# EAGLE design 2lampen (EAGLE 6.3)
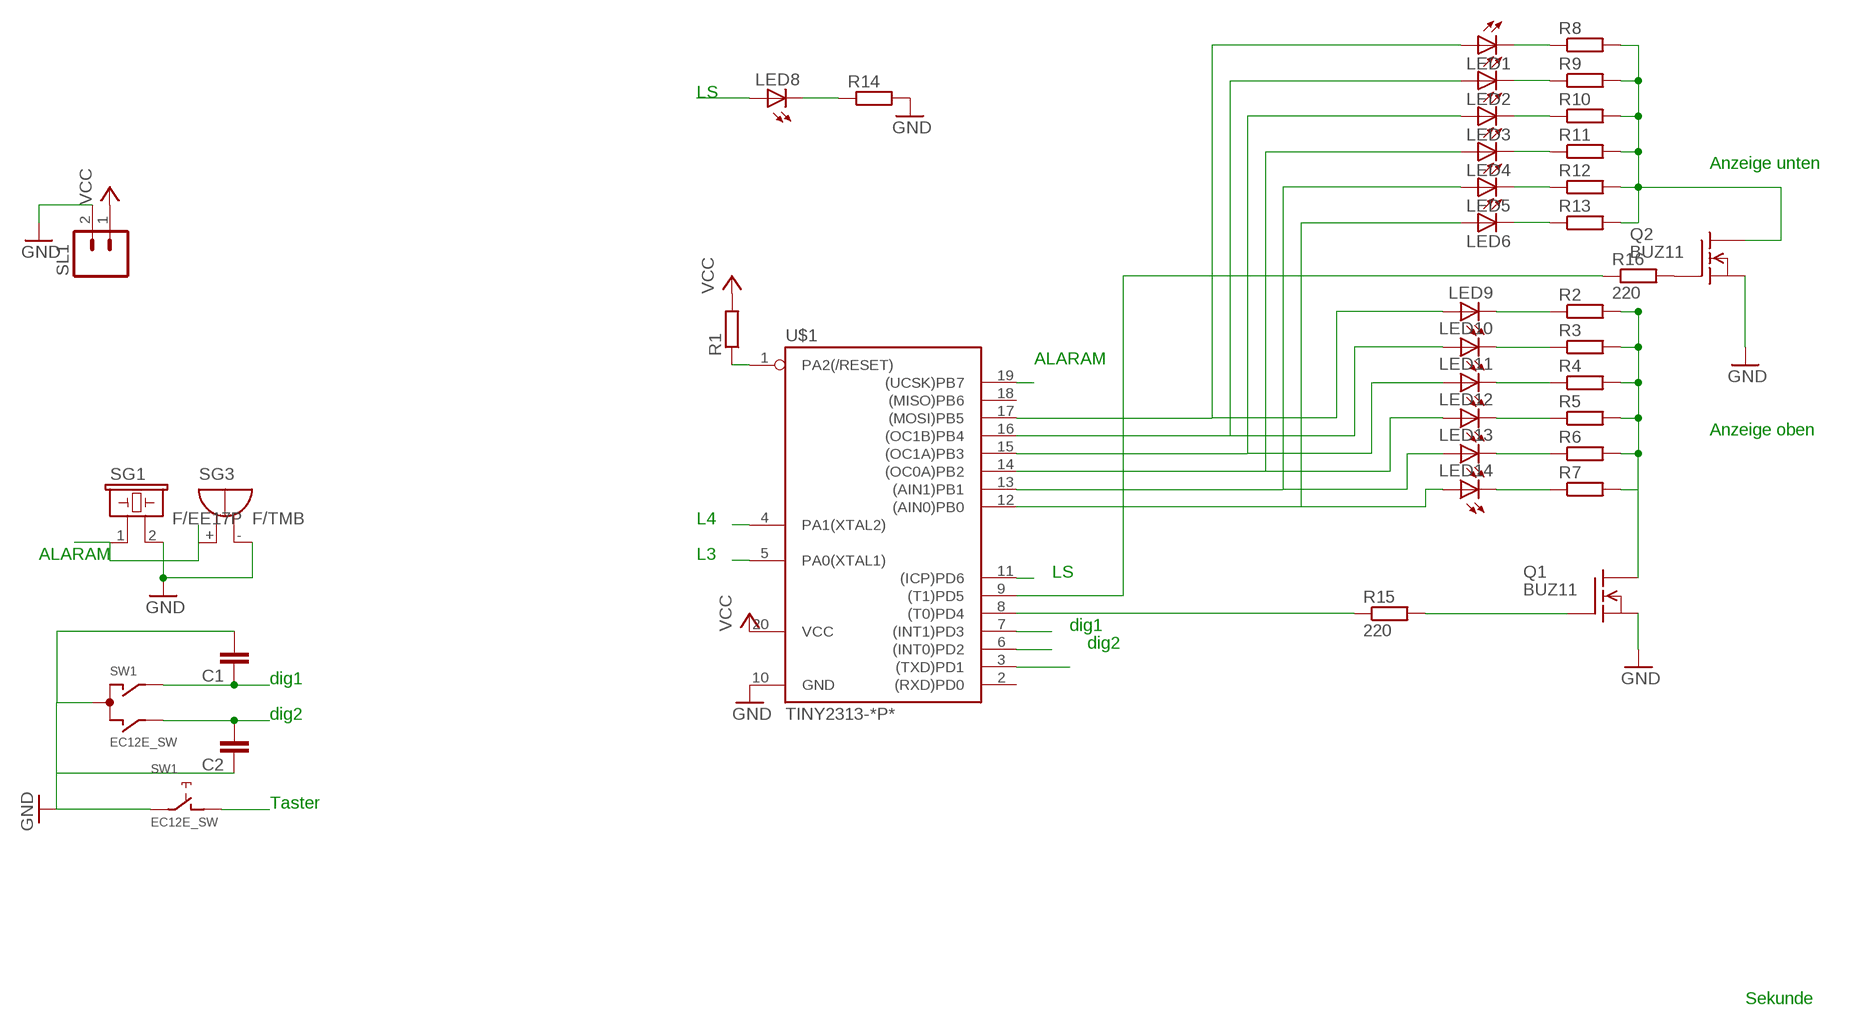
[diagram p0: schematic, sheet 1]

## Parts
C1  C-EU025-025X050  [C025-025X050]
C2  C-EU025-025X050  [C025-025X050]
LED1  LED5MM  [LED5MM]
LED2  LED5MM  [LED5MM]
LED3  LED5MM  [LED5MM]
LED4  LED5MM  [LED5MM]
LED5  LED5MM  [LED5MM]
LED6  LED5MM  [LED5MM]
LED8  LED3MM  [LED3MM]
LED9  LED5MM  [LED5MM]
LED10  LED5MM  [LED5MM]
LED11  LED5MM  [LED5MM]
LED12  LED5MM  [LED5MM]
LED13  LED5MM  [LED5MM]
LED14  LED5MM  [LED5MM]
Q1  BUZ11  [TO220]
Q2  BUZ11  [TO220]
R1  R-EU_0204/7  [0204/7]
R2  R-EU_0204/2V  [0204V]
R3  R-EU_0204/2V  [0204V]
R4  R-EU_0204/2V  [0204V]
R5  R-EU_0204/2V  [0204V]
R6  R-EU_0204/2V  [0204V]
R7  R-EU_0204/2V  [0204V]
R8  R-EU_0204/2V  [0204V]
R9  R-EU_0204/2V  [0204V]
R10  R-EU_0204/2V  [0204V]
R11  R-EU_0204/2V  [0204V]
R12  R-EU_0204/2V  [0204V]
R13  R-EU_0204/7  [0204/7]
R14  R-EU_0204/2V  [0204V]
R15  220  R-EU_0204/2V  [0204V]
R16  220  R-EU_0204/2V  [0204V]
SG1  F/EE17P  [F/EE17P]
SG3  F/TMB  [F/TMB]
SL1  M02  [02P]
SW1  EC12E_SW  [ALPS_EC12E_SW]
U$1  TINY2313-*P*  [DIL20]

## Nets
ALARM: SG1.1 SG3.+ U$1.19((UCSK)PB7)
DIG1: C1.1 SW1.A U$1.7((INT1)PD3)
DIG2: C2.2 SW1.B U$1.6((INT0)PD2)
GND: C1.2 C2.1 Q1.3(S) Q2.3(S) R14.2 SG1.2 SG3.- SL1.2 SW1.C SW1.E U$1.10(GND)
L1: LED1.A LED9.A U$1.17((MOSI)PB5)
L2: LED2.A LED10.A U$1.16((OC1B)PB4)
L3: LED3.A LED11.A U$1.5(PA0(XTAL1)) U$1.15((OC1A)PB3)
L4: LED4.A LED12.A U$1.4(PA1(XTAL2)) U$1.14((OC0A)PB2)
L5: LED5.A LED13.A U$1.13((AIN1)PB1)
L6: LED6.A LED14.A U$1.12((AIN0)PB0)
LS: LED8.A U$1.11((ICP)PD6)
N$1: LED6.K(C) R13.1
N$2: LED5.K(C) R12.1
N$3: LED4.K(C) R11.1
N$4: LED3.K(C) R10.1
N$5: Q1.2(D) R2.2 R3.2 R4.2 R5.2 R6.2 R7.2
N$6: LED2.K(C) R9.1
N$7: U$1.3((TXD)PD1)
N$8: LED1.K(C) R8.1
N$10: LED8.K(C) R14.1
N$17: LED9.K(C) R2.1
N$18: LED10.K(C) R3.1
N$19: LED11.K(C) R4.1
N$20: LED12.K(C) R5.1
N$21: LED13.K(C) R6.1
N$22: LED14.K(C) R7.1
N$30: Q2.2(D) R8.2 R9.2 R10.2 R11.2 R12.2 R13.2
N$31: Q1.1(G) R15.2
N$32: Q2.1(G) R16.2
N$33: R16.1 U$1.9((T1)PD5)
N$34: R15.1 U$1.8((T0)PD4)
RESET: R1.1 U$1.1(PA2(/RESET))
TAST: SW1.D
VCC: R1.2 SL1.1 U$1.20(VCC)
Unconnected: SW1.GND1(G) SW1.GND2(G) U$1.2((RXD)PD0) U$1.18((MISO)PB6)

## Notes on the sheet
- LS
- Anzeige unten
- ALARAM
- Anzeige oben
- L4
- ALARAM | L3
- LS
- dig1
- dig2
- dig1
- dig2
- Taster
- Sekunde

## Library data of the parts
C1 C2 = rcl:C-EU: CAPACITOR, European symbol
LED1-LED6 LED8-LED14 = led:LED: LED OSRAM: - CHIPLED LG R971, LG N971, LY N971, LG Q971, LY Q971, LO R971, LY R971 LH N974, LH R974 LS Q976, LO Q976, LY Q976 LO Q996 - Hyper CHIPLED LW Q18S LB Q993, LB Q99A, LB R99A - SideLED LS A670, LO A670, LY A670, LG A670, LP A670 LB A673, LV A673, LT A673, LW A673 LH A674 LY A675 LS A676, LA A676, LO A676, LY A676, LW A676 LS A679, LY A679, LG A679 - Hyper Micro SIDELED® LS Y876, LA Y876, LO Y876, LY Y876 LT Y87S - SmartLED LW L88C, LW L88S LB L89C, LB L89S, LG L890 LS L89K, LO L89K, LY L89K LS L896, LA L896, LO L896, LY L896 - TOPLED LS T670, LO T670, LY T670, LG T670, LP T670 LSG T670, LSP T670, LSY T670, LOP T670, LYG T670 LG T671, LOG T671, LSG T671 LB T673, LV T673, LT T673, LW T673 LH T674 LS T676, LA T676, LO T676, LY T676, LB T676, LH T676, LSB T676, LW T676 LB T67C, LV T67C, LT T67C, LS T67K, LO T67K, LY T67K, LW E67C LS E67B, LA E67B, LO E67B, LY E67B, LB E67C, LV E67C, LT E67C LW T67C LS T679, LY T679, LG T679 LS T770, LO T770, LY T770, LG T770, LP T770 LB T773, LV T773, LT T773, LW T773 LH T774 LS E675, LA E675, LY E675, LS T675 LS T776, LA T776, LO T776, LY T776, LB T776 LHGB T686 LT T68C, LB T68C - Hyper Mini TOPLED® LB M676 - Mini TOPLED Santana® LG M470 LS M47K, LO M47K, LY M47K Source: http://www.osram.convergy.de LUXEON: - LUMILED® LXK2-PW12-R00, LXK2-PW12-S00, LXK2-PW14-U00, LXK2-PW14-V00 LXK2-PM12-R00, LXK2-PM12-S00, LXK2-PM14-U00 LXK2-PE12-Q00, LXK2-PE12-R00, LXK2-PE12-S00, LXK2-PE14-T00, LXK2-PE14-U00 LXK2-PB12-K00, LXK2-PB12-L00, LXK2-PB12-M00, LXK2-PB14-N00, LXK2-PB14-P00, LXK2-PB14-Q00 LXK2-PR12-L00, LXK2-PR12-M00, LXK2-PR14-Q00, LXK2-PR14-R00 LXK2-PD12-Q00, LXK2-PD12-R00, LXK2-PD12-S00 LXK2-PH12-R00, LXK2-PH12-S00 LXK2-PL12-P00, LXK2-PL12-Q00, LXK2-PL12-R00 Source: www.luxeon.com KINGBRIGHT: KA-3528ASYC Source: www.kingbright.com
Q1 Q2 = transistor-fet:BUZ11: N-Channel Enhancement MOSFET 50V; 30A; 0,040Ohm
R1-R16 = rcl:R-EU_: RESISTOR, European symbol
SG1 = buzzer:F/EE17P: BUZZER Source: Buerklin; OC_FARNELL: unknown; OC_NEWARK: unknown
SG3 = buzzer:F/TMB: BUZZER Source: Buerklin; OC_FARNELL: unknown; OC_NEWARK: unknown
SL1 = con-amp-quick:M02: AMP QUICK CONNECTOR
SW1 = switch-alps:EC12E_SW: ALPS rotary Encoder EC12E series with switch; MPN: EC12E2424407; OC_FARNELL: 1520813; OC_NEWARK: 74M1068
U$1 = avr-6:TINY2313*: Atmel Tiny2313 2K Flash, 128 bytes EEPROM, 128 bytes RAM

## Board
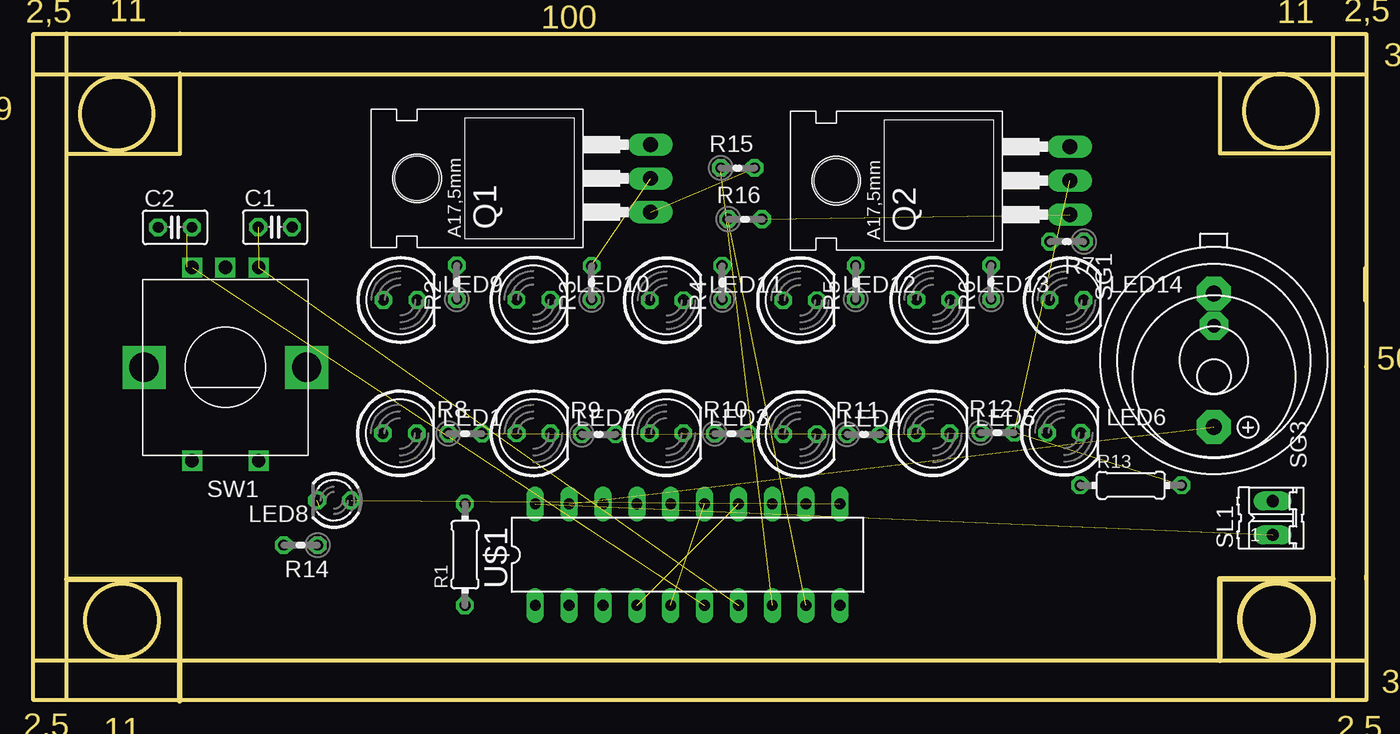
[diagram p1: board, top side]
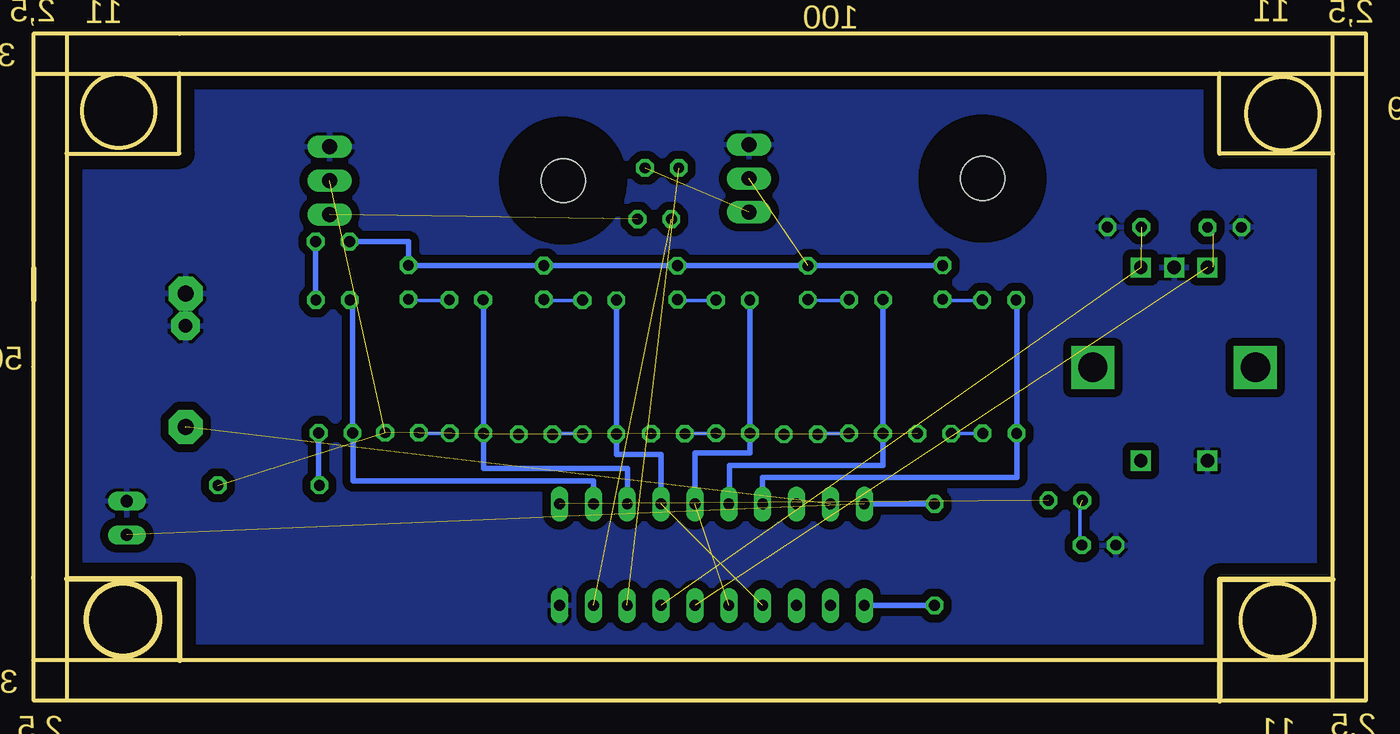
[diagram p2: board, bottom side, seen from below]

Size 100 x 50.09 mm. Coordinates in mm from the lower left corner, seen from the top.
Outline: 2.51,0.04 0,0.04 0,3.04
Outline: 97.5,0.04 100,0.04
Outline: 0,0.03 0,0.03 0,3.04
Outline: 0,3.04 0,47.04
Outline: 0,47.04 0,50.04 100,50.04 100,0.04 97.5,0.04
Outline: 97.5,0.04 2.51,0.04
Outline: 2.5,0.04 0,0.04 0,0.04
Outline: 0,3.04 100,3.04 100,3.05
Outline: 0,47.04 100,47.04 100,47.03
Outline: 2.51,0.04 2.5,0.04
Outline: 2.5,0.04 2.5,9.11
Outline: 2.5,9.11 2.5,50.09
Outline: 97.5,50.05 97.5,50.05 97.5,0.04
Outline: 11,50.07 11,50.07
Outline: 89.04,50.05 89.03,50.05
Outline: 100,9.12 100,9.35
Outline: 2.5,9.11 11,9.11 11,0
Outline: 2.5,41.06 11.01,41.06 11.01,47.07
Outline: 97.53,41.07 89.05,41.07 89.05,47.08
Outline: 97.51,9.15 89.03,9.15 89.03,3.03
Outline: 100,25.05 100,25.07
Outline: 99.97,32.43 99.98,30.08
Outline: circle at 93.27,6.08 radius 2.74
Outline: circle at 93.61,44.27 radius 2.74
Outline: circle at 6.26,44.07 radius 2.74
Outline: circle at 6.65,6.04 radius 2.74
Copper layers (1*16): Top 0.035mm / dielectric 1.5mm / Bottom 0.035mm
Design rules "default": minimum track width 10mil, minimum drill 24mil, track to track 8mil, track to pad 8mil, pad to pad 8mil, via to via 8mil, smd to smd 8mil, copper to edge 40mil, drill to drill 8mil, minimum pad ring 10mil, minimum via ring 8mil, stop-mask expansion 4mil, vias tented up to drill 0mil, thermal gap 10mil

### Footprints (pad centres in the part's own frame; a part is rotated, then mirrored left to right if it is on the bottom)
C025-025X050 = drill 0.813 octagon: 1 -1.27,0; 2 1.27,0
LED5MM = drill 0.813 octagon: A -1.27,0; K 1.27,0
LED3MM = drill 0.813 octagon: A -1.27,0; K 1.27,0
TO220 = drill 1.118 long: 1 -2.54,-6.35; 2 0,-6.35; 3 2.54,-6.35 | hole 3.302: 0,11.176
0204/7 = drill 0.813 octagon: 1 -3.81,0; 2 3.81,0
0204V = drill 0.813 octagon: 1 -1.27,0; 2 1.27,0
F/EE17P = drill 1.194 pad 2.54 octagon: 1 -5.004,0; 2 5.004,0
F/TMB = drill 1.016 pad 2.159 octagon: + 3.81,0; - -3.81,0
02P = drill 0.914 long: 1 -1.27,0; 2 1.27,0
ALPS_EC12E_SW = drill 1 square: A -2.5,-7.5; B 2.5,-7.5; C 0,-7.5; D -2.5,7; E 2.5,7 | drill 2.2 square: GND1 -6.1,0; GND2 6.1,0
DIL20 = drill 0.813 long: 1 -11.43,-3.81; 2 -8.89,-3.81; 3 -6.35,-3.81; 4 -3.81,-3.81; 5 -1.27,-3.81; 6 1.27,-3.81; 7 3.81,-3.81; 8 6.35,-3.81; 9 8.89,-3.81; 10 11.43,-3.81; 11 11.43,3.81; 12 8.89,3.81; 13 6.35,3.81; 14 3.81,3.81; 15 1.27,3.81; 16 -1.27,3.81; 17 -3.81,3.81; 18 -6.35,3.81; 19 -8.89,3.81; 20 -11.43,3.81

### Placement (x,y rotation side)
C1  18.14,35.55 0 top
C2  10.63,35.53 0 top
LED1  27.5,20.07 0 top
LED2  37.53,20.06 0 top
LED3  47.51,20.07 0 top
LED4  57.53,20.01 0 top
LED5  67.5,20.06 0 top
LED6  77.33,20.1 0 top
LED8  22.57,15.03 180 top
LED9  27.53,30.07 0 top
LED10  37.52,30.1 0 top
LED11  47.52,30.06 0 top
LED12  57.53,30.06 0 top
LED13  67.53,30.08 0 top
LED14  77.53,30.07 0 top
Q1  39.96,39.2 90 top
Q2  71.42,39.03 90 top
R1  32.39,10.96 90 top
R2  31.78,31.4 90 top
R3  41.89,31.37 90 top
R4  51.68,31.38 90 top
R5  61.71,31.39 90 top
R6  71.86,31.4 90 top
R7  77.55,34.45 180 top
R8  32.4,20.05 0 top
R9  42.42,19.99 0 top
R10  52.39,20.04 0 top
R11  62.32,19.99 0 top
R12  72.34,20.11 0 top
R13  82.35,16.16 0 top
R14  20.06,11.67 180 top
R15  52.84,39.98 0 top
R16  53.4,36.14 0 top
SG1  88.58,25.55 90 top
SG3  88.59,24.33 270 top
SL1  93,13.71 90 top
SW1  14.41,25.02 180 top
U$1  49.09,10.95 0 top

### Tracks (layer width: path | path; a pad name or v marks a point on that pad's centre or on a via)
ALARM  (2 unrouted)
DIG1  (2 unrouted)
DIG2  (2 unrouted)
  Bottom 0.254: 11.5,35.04 C2.2 | 11.5,32.54 SW1.B
GND
  pour Bottom (isolate 0.61, rank 6): -8.7,58.73 107.07,58.73 107.07,-13.28 -8.83,-13.28 -8.83,58.86
L1
  Bottom 0.406: LED9.A 26.23,30.07 LED1.A 26.23,16.76 45.3,16.76 45.3,14.76 U$1.17
L2
  Bottom 0.406: LED10.A 36.26,30.1 LED2.A 36.26,17.66 47.78,17.66 47.78,14.76 U$1.16
L3  (1 unrouted)
  Bottom 0.406: LED11.A 46.24,30.06 LED3.A 46.24,18.61 50.35,18.61 50.35,14.76 U$1.15
L4  (1 unrouted)
  Bottom 0.406: LED12.A LED4.A 56.26,18.47 52.91,18.47 52.91,14.76 U$1.14
L5
  Bottom 0.406: LED13.A 66.23,30.08 LED5.A 66.23,17.44 55.44,17.44 U$1.13
L6
  Bottom 0.406: LED14.A 76.06,30.07 LED6.A 76.02,20.1 76.02,16.49 57.98,16.49 U$1.12
LS  (1 unrouted)
N$1
  Bottom 0.406: LED6.K 78.6,16.16 R13.1
N$2
  Bottom 0.254: LED5.K 69,20.04 71,20.04 R12.1
N$3
  Bottom 0.254: R11.1 61,20.04 59,20.04 LED4.K
N$4
  Bottom 0.254: R10.1 51,20.04 49,20.04 LED3.K
N$5  (1 unrouted)
  Bottom 0.406: R2.2 31.78,32.64 R3.2 R4.2 51.68,32.66 R5.2 61.71,32.76 61.67,32.76 61.67,32.67 R6.2 71.86,34.45 R7.2
N$6
  Bottom 0.254: R9.1 41,20.04 39,20.04 LED2.K
N$8
  Bottom 0.254: R8.1 31,20.04 29,20.04 LED1.K
N$10  (1 unrouted)
  Bottom 0.254: 21.5,14.54 21.5,12.04 R14.1
N$17
  Bottom 0.254: LED9.K 29,30.04 31,30.04 R2.1
N$18
  Bottom 0.254: LED10.K 39,30.04 41,30.04 R3.1
N$19
  Bottom 0.254: LED11.K 49,30.04 51,30.04 R4.1
N$20
  Bottom 0.254: LED12.K 59,30.04 61,30.04 R5.1
N$21
  Bottom 0.254: LED13.K 69,30.04 71,30.04 R6.1
N$22
  Bottom 0.406: R7.1 78.82,30.07 LED14.K
N$30  (6 unrouted)
N$31  (1 unrouted)
N$32  (1 unrouted)
N$33  (1 unrouted)
N$34  (1 unrouted)
RESET
  Bottom 0.406: U$1.1 R1.1
VCC  (1 unrouted)
  Bottom 0.406: R1.2 U$1.20

### Text on the board
Dimension: 2,5 | 11 | 11 | 2,5 | 100 | 3 | 3 | 9 | 50 | 9 | 3 | 3 | 2,5 | 11 | 2,5